# EAGLE design PDV (EAGLE 9.6.0)
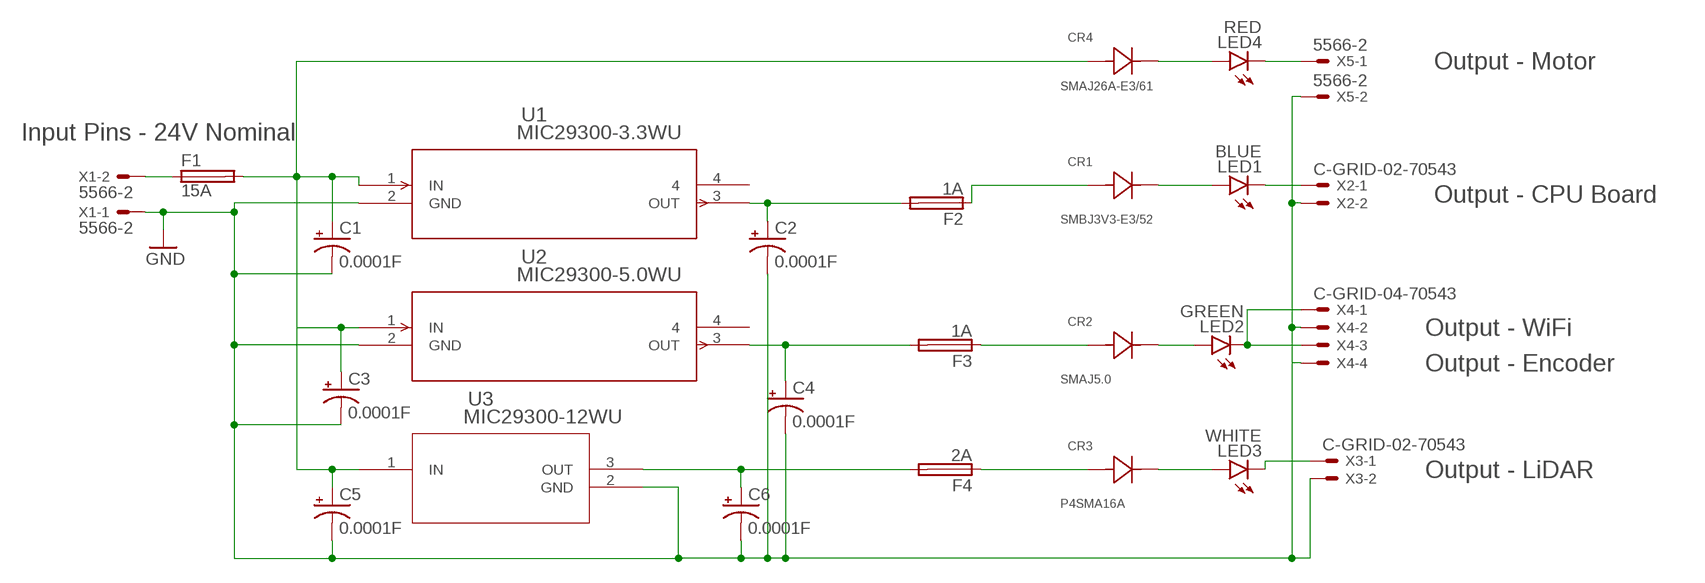
[diagram p0: schematic, sheet 1]

## Parts
C1  0.0001F  CPOL-USE2.5-6  [E2,5-6]
C2  0.0001F  CPOL-USE2.5-6  [E2,5-6]
C3  0.0001F  CPOL-USE2.5-6  [E2,5-6]
C4  0.0001F  CPOL-USE2.5-6  [E2,5-6]
C5  0.0001F  CPOL-USE2.5-6  [E2,5-6]
C6  0.0001F  CPOL-USE2.5-6  [E2,5-6]
CR1  SMBJ3V3-E3/52  [CR_V3-E3/52_VIS]
CR2  SMAJ5.0  [SMASERIES_LTF]
CR3  P4SMA16A  [P4SMASERIES_LTF]
CR4  SMAJ26A-E3/61  [DIODE_DO-214AC]
F1  15A  TE5  [TE5]
F2  1A  TE5  [TE5]
F3  1A  TE5  [TE5]
F4  2A  TE5  [TE5]
LED1  BLUE  LEDSMT1206  [1206]
LED2  GREEN  LEDSMT1206  [1206]
LED3  WHITE  LEDSMT1206  [1206]
LED4  RED  LEDSMT1206  [1206]
U1  MIC29300-3.3WU  [TO-263-3_MCL]
U2  MIC29300-5.0WU  [TO-263-3_MCL]
U3  MIC29300-12WU  [TO220-3LD-PL-1_MCH]
X1  5566-2  [5566-2]
X2  C-GRID-02-70543  [70543-02]
X3  C-GRID-02-70543  [70543-02]
X4  C-GRID-04-70543  [70543-04]
X5  5566-2  [5566-2]

## Nets
GND: C1.- C2.- C3.- C4.- C5.- C6.- U1.2(GND) U2.2(GND) U3.2(GND) X1.1 X2.2 X3.2 X4.2 X4.4 X5.2
N$1: F1.1 X1.2
N$2: C1.+ C3.+ C5.+ CR4.2 F1.2 U1.1(IN) U2.1(IN) U3.1(IN)
N$3: C2.+ F2.2 U1.3(OUT)
N$4: C4.+ F3.2 U2.3(OUT)
N$5: C6.+ F4.2 U3.3(OUT)
N$7: CR1.2 F2.1
N$8: CR2.2 F3.1
N$9: CR3.2 F4.1
N$13: CR4.1 LED4.A
N$14: LED4.C X5.1
N$15: CR1.1 LED1.A
N$16: LED1.C X2.1
N$17: CR2.1 LED2.A
N$18: LED2.C X4.1 X4.3
N$19: CR3.1 LED3.A
N$20: LED3.C X3.1
Unconnected: U1.4 U2.4

## Notes on the sheet
- Output - Motor
- Input Pins - 24V Nominal
- Output - CPU Board
- Output - WiFi
- Output - Encoder
- Output - LiDAR

## Library data of the parts
C1-C6 = rcl:CPOL-US: POLARIZED CAPACITOR, American symbol; SPICEPREFIX: C
CR1 = SMBJ3V3-E3:SMBJ3V3-E3/52; COPYRIGHT: Copyright (C) 2025 Ultra Librarian. All rights reserved.; MANUFACTURER_PART_NUMBER: SMBJ3V3-E3/52; MFR_NAME: Vishay
CR2 = SMAJ5.0:SMAJ5.0; COPYRIGHT: Copyright (C) 2025 Ultra Librarian. All rights reserved.; MANUFACTURER_PART_NUMBER: SMAJ5.0; MFR_NAME: Littelfuse Inc
CR3 = P4SMA16A:P4SMA16A; COPYRIGHT: Copyright (C) 2025 Ultra Librarian. All rights reserved.; MANUFACTURER_PART_NUMBER: P4SMA16A; MFR_NAME: Littelfuse Inc
CR4 = SMAJ26A-E3:SMAJ26A-E3/61; COPYRIGHT: Copyright (C) 2025 Ultra Librarian. All rights reserved.; MANUFACTURER_PART_NUMBER: SMAJ26A-E3/61; MFR_NAME: Vishay
F1-F4 = fuse:TE5: FUSE Wickmann; OC_FARNELL: unknown; OC_NEWARK: unknown
LED1-LED4 = led:LED: LED OSRAM: - CHIPLED LG R971, LG N971, LY N971, LG Q971, LY Q971, LO R971, LY R971 LH N974, LH R974 LS Q976, LO Q976, LY Q976 LO Q996 - Hyper CHIPLED LW Q18S LB Q993, LB Q99A, LB R99A - SideLED LS A670, LO A670, LY A670, LG A670, LP A670 LB A673, LV A673, LT A673, LW A673 LH A674 LY A675 LS A676, LA A676, LO A676, LY A676, LW A676 LS A679, LY A679, LG A679 - Hyper Micro SIDELED® LS Y876, LA Y876, LO Y876, LY Y876 LT Y87S - SmartLED LW L88C, LW L88S LB L89C, LB L89S, LG L890 LS L89K, LO L89K, LY L89K LS L896, LA L896, LO L896, LY L896 - TOPLED LS T670, LO T670, LY T670, LG T670, LP T670 LSG T670, LSP T670, LSY T670, LOP T670, LYG T670 LG T671, LOG T671, LSG T671 LB T673, LV T673, LT T673, LW T673 LH T674 LS T676, LA T676, LO T676, LY T676, LB T676, LH T676, LSB T676, LW T676 LB T67C, LV T67C, LT T67C, LS T67K, LO T67K, LY T67K, LW E67C LS E67B, LA E67B, LO E67B, LY E67B, LB E67C, LV E67C, LT E67C LW T67C LS T679, LY T679, LG T679 LS T770, LO T770, LY T770, LG T770, LP T770 LB T773, LV T773, LT T773, LW T773 LH T774 LS E675, LA E675, LY E675, LS T675 LS T776, LA T776, LO T776, LY T776, LB T776 LHGB T686 LT T68C, LB T68C - Hyper Mini TOPLED® LB M676 - Mini TOPLED Santana® LG M470 LS M47K, LO M47K, LY M47K Source: http://www.osram.convergy.de LUXEON: - LUMILED® LXK2-PW12-R00, LXK2-PW12-S00, LXK2-PW14-U00, LXK2-PW14-V00 LXK2-PM12-R00, LXK2-PM12-S00, LXK2-PM14-U00 LXK2-PE12-Q00, LXK2-PE12-R00, LXK2-PE12-S00, LXK2-PE14-T00, LXK2-PE14-U00 LXK2-PB12-K00, LXK2-PB12-L00, LXK2-PB12-M00, LXK2-PB14-N00, LXK2-PB14-P00, LXK2-PB14-Q00 LXK2-PR12-L00, LXK2-PR12-M00, LXK2-PR14-Q00, LXK2-PR14-R00 LXK2-PD12-Q00, LXK2-PD12-R00, LXK2-PD12-S00 LXK2-PH12-R00, LXK2-PH12-S00 LXK2-PL12-P00, LXK2-PL12-Q00, LXK2-PL12-R00 Source: www.luxeon.com KINGBRIGHT: KA-3528ASYC Source: www.kingbright.com
U1 = MIC29300-3.3:MIC29300-3.3WU; COPYRIGHT: Copyright (C) 2025 Ultra Librarian. All rights reserved.; MANUFACTURER_PART_NUMBER: MIC29300-3.3WU; MFR_NAME: Micrel / Microchip Technology
U2 = MIC29300-5.0lbr:MIC29300-5.0WU; COPYRIGHT: Copyright (C) 2025 Ultra Librarian. All rights reserved.; MANUFACTURER_PART_NUMBER: MIC29300-5.0WU; MFR_NAME: Micrel / Microchip Technology
U3 = MIC29300-12:MIC29300-12WU; COPYRIGHT: Copyright (C) 2025 Ultra Librarian. All rights reserved.; MANUFACTURER_PART_NUMBER: MIC29300-12WU; MFR_NAME: Micrel / Microchip Technology
X1 X5 = con-molex:5566-2: Mini FIT connector 2 pol Source: http://www.molex.com; MF: MOLEX; OC_FARNELL: 1822072; OC_NEWARK: unknown
X2 X3 = con-molex:C-GRID-02: CONNECTOR wire to board 2.54 mm (0.100") pitch header; MF: MOLEX; OC_FARNELL: unknown; OC_NEWARK: unknown
X4 = con-molex:C-GRID-04: CONNECTOR wire to board 2.54 mm (0.100") pitch header; MF: MOLEX; OC_FARNELL: unknown; OC_NEWARK: unknown

## Board
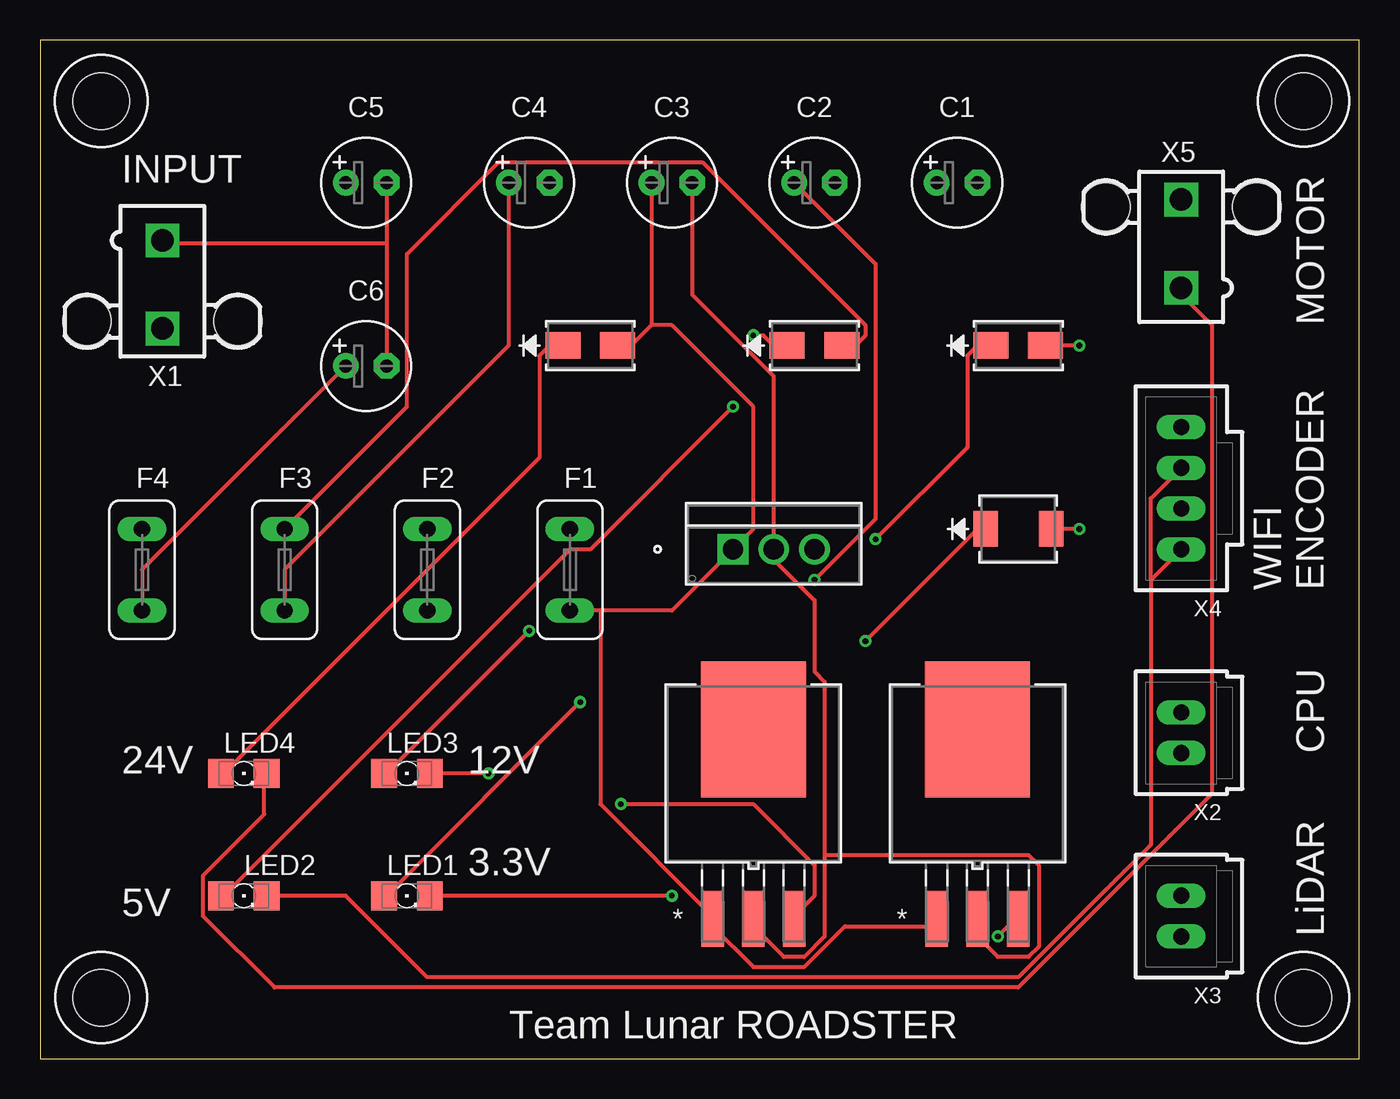
[diagram p1: board, top side]
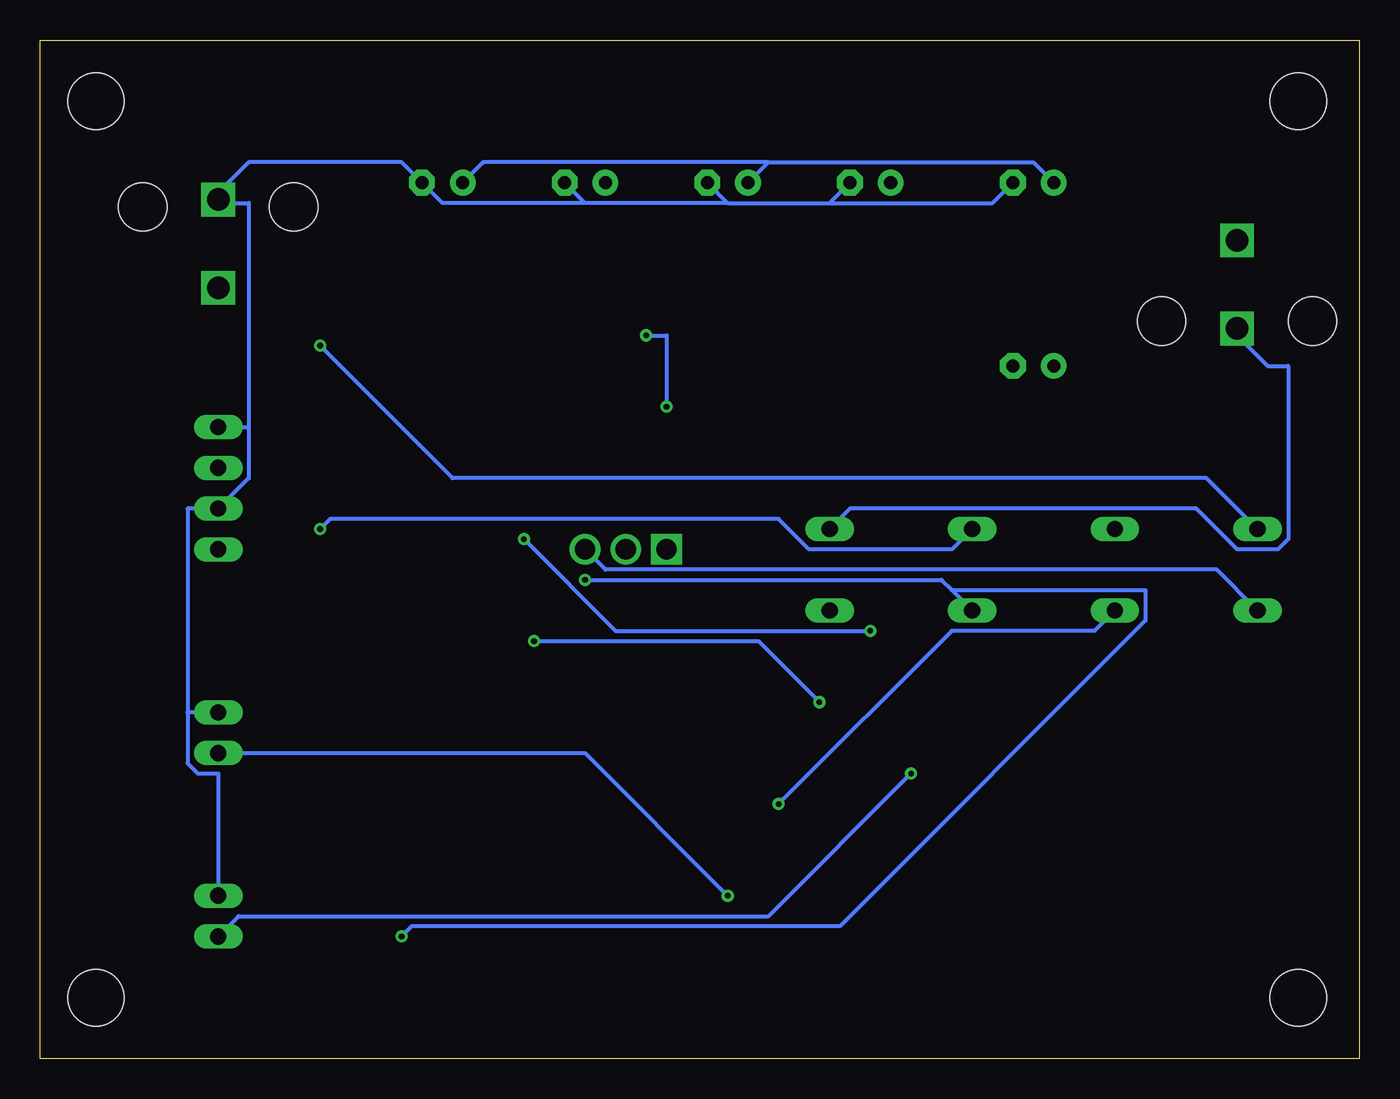
[diagram p2: board, bottom side, seen from below]

Size 82.22 x 63.49 mm. Coordinates in mm from the lower left corner, seen from the top.
Outline: 0,0 82.22,0 82.22,63.49 0,63.49 0,0
Copper layers (1*16): Top 0.035mm / dielectric 1.5mm / Bottom 0.035mm
Design rules "default *": minimum track width 10mil, minimum drill 0.35mm, track to track 6mil, track to pad 6mil, pad to pad 6mil, via to via 6mil, smd to smd 6mil, copper to edge 40mil, drill to drill 6mil, minimum pad ring 10mil, minimum via ring 8mil, stop-mask expansion 4mil, vias tented up to drill 0mil, thermal gap 10mil
Holes 3.51 mm at 3.81,59.69 78.74,59.69 78.74,3.81 3.81,3.81

### Footprints (pad centres in the part's own frame; a part is rotated, then mirrored left to right if it is on the bottom)
E2,5-6 = drill 0.813 pad 1.6: + -1.27,0 | drill 0.813 pad 1.6 octagon: - 1.27,0
CR_V3-E3/52_VIS = smd 1.524 x 2.21: 1 -2.035,0; 2 2.035,0
SMASERIES_LTF = smd 2.184 x 1.651: 1 -1.702,0; 2 1.702,0
P4SMASERIES_LTF = smd 2.184 x 1.651: 1 -1.702,0; 2 1.702,0
DIODE_DO-214AC = smd 2.184 x 1.651: 1 -1.702,0; 2 1.702,0
TE5 = drill 1.016 long: 1 -2.54,0; 2 2.54,0
1206 = smd 1.6 x 1.803: A -1.422,0; C 1.422,0
TO-263-3_MCL = smd 1.397 x 3.505: 1 -2.54,-9.055; 2 0,-9.055; 3 2.54,-9.055 | smd 6.553 x 8.458: 4 0,2.743
TO220-3LD-PL-1_MCH = drill 1.27 pad 1.778 square: 1 0,0 | drill 1.27 pad 1.778: 2 2.54,0; 3 5.08,0
5566-2 = drill 1.4 square: 1 0,-2.75; 2 0,2.75 | hole 3: 4.7,2.29; -4.7,2.29
70543-02 = drill 1.016 long: 1 -1.27,0; 2 1.27,0
70543-04 = drill 1.016 long: 1 -3.81,0; 2 -1.27,0; 3 1.27,0; 4 3.81,0

### Placement (x,y rotation side)
C1  57.15,54.61 0 top
C2  48.26,54.61 0 top
C3  39.37,54.61 0 top
C4  30.48,54.61 0 top
C5  20.32,54.61 0 top
C6  20.32,43.18 0 top
CR1  60.96,33.02 0 top
CR2  48.26,44.45 0 top
CR3  60.96,44.45 0 top
CR4  34.29,44.45 0 top
F1  33.02,30.48 270 top
F2  24.13,30.48 270 top
F3  15.24,30.48 270 top
F4  6.35,30.48 270 top
LED1  22.86,10.16 0 top
LED2  12.7,10.16 0 top
LED3  22.86,17.78 0 top
LED4  12.7,17.78 0 top
U1  58.42,17.78 0 top
U2  44.45,17.78 0 top
U3  43.18,31.75 0 top
X1  7.62,48.26 180 top
X2  71.12,20.32 90 top
X3  71.12,8.89 90 top
X4  71.12,35.56 90 top
X5  71.12,50.8 0 top

### Tracks (layer width: path | path; a pad name or v marks a point on that pad's centre or on a via)
GND
  Top 0.254: 48.89,12.7 48.89,23.5 48.26,24.13 48.26,28.58 45.72,31.12 U3.2 45.72,42.55 40.64,47.62 C3.- | 48.89,12.7 48.89,7.62 47.62,6.35 46.36,6.35 44.45,8.26 U2.2 | U1.2 58.42,7.62 59.69,6.35 61.59,6.35 62.23,6.98 62.23,12.06 61.59,12.7 48.89,12.7 | C5.- 21.59,50.8 | 21.59,50.8 C6.- | 21.59,50.8 7.62,50.8 X1.1
  Bottom 0.254: X3.2 71.12,17.78 72.39,17.78 73.03,18.41 73.03,21.59 | X2.2 73.03,21.59 | 69.22,39.37 69.22,36.2 X4.2 73.03,34.29 73.03,21.59 | X4.4 69.22,39.37 | 33.02,53.34 C4.- | 39.37,53.34 33.02,53.34 | C3.- 39.37,53.34 | 48.26,53.34 C2.- | 39.37,53.34 48.26,53.34 | 48.26,53.34 57.15,53.34 C1.- 59.69,55.88 69.22,55.88 71.12,53.97 X5.2 71.12,53.34 69.22,53.34 69.22,39.37 | C5.- 22.86,53.34 33.02,53.34
N$1
  Bottom 0.254: F1.1 31.75,34.29 10.16,34.29 7.62,31.75 5.08,31.75 4.45,32.38 4.45,43.18 5.71,43.18 7.62,45.09 X1.2
N$2
  Top 0.254: CR4.2 36.83,44.45 38.1,45.72 | C3.+ 38.1,45.72 | 34.92,27.94 39.37,27.94 U3.1 44.45,33.02 44.45,40.64 39.37,45.72 38.1,45.72 | 34.92,27.94 F1.2 | 34.92,27.94 34.92,15.87 41.91,8.89 U2.1 41.91,8.26 44.45,5.71 47.62,5.71 50.16,8.26 55.88,8.26 U1.1
  Bottom 0.254: C5.+ 20.32,55.88 36.83,55.88 | C3.+ 36.83,55.88 | C1.+ 54.61,55.88 36.83,55.88
N$3  (via drill 0.35)
  Top 0.254: v48.26,29.84 52.07,33.66 52.07,49.53 C2.+ | v59.69,7.62 60.33,8.26 60.96,8.26 U1.3
  Bottom 0.254: 25.4,29.21 26.03,29.84 v48.26,29.84 | 25.4,29.21 F2.2 | v59.69,7.62 59.05,8.26 32.38,8.26 13.33,27.3 13.33,29.21 25.4,29.21
N$4  (via drill 0.35)
  Top 0.254: F3.2 15.24,30.48 29.21,44.45 C4.+ | v36.2,15.87 44.45,15.87 48.26,12.06 48.26,10.16 46.99,8.89 U2.3
  Bottom 0.254: v36.2,15.87 25.4,26.67 16.51,26.67 F3.2
N$5
  Top 0.254: F4.2 6.35,30.48 C6.+
  Bottom 0.254: U3.3 46.99,30.48 8.89,30.48 F4.2
N$7  (via drill 0.35)
  Top 0.254: v64.77,33.02 CR1.2
  Bottom 0.254: v64.77,33.02 64.14,33.66 36.2,33.66 34.29,31.75 25.4,31.75 F2.1
N$8
  Top 0.254: CR2.2 50.8,44.45 51.44,45.09 51.44,45.72 41.27,55.88 28.57,55.88 22.86,50.17 22.86,40.64 F3.1
N$9  (via drill 0.35)
  Top 0.254: v64.77,44.45 CR3.2
  Bottom 0.254: v64.77,44.45 56.52,36.2 9.52,36.2 F4.1
N$13
  Top 0.254: CR4.1 31.75,44.45 31.12,43.81 31.12,37.47 11.43,17.78 LED4.A
N$14
  Top 0.254: LED4.C 13.97,17.78 13.97,15.24 10.16,11.43 10.16,8.89 14.6,4.44 60.96,4.44 73.03,16.51 73.03,45.72 71.12,47.62 X5.1
N$15  (via drill 0.35)
  Top 0.254: v33.66,22.23 21.59,10.16 LED1.A | v51.44,26.04 58.42,33.02 CR1.1
  Bottom 0.254: v33.66,22.23 37.46,26.04 v51.44,26.04
N$16  (via drill 0.35)
  Top 0.254: v39.37,10.16 LED1.C
  Bottom 0.254: v39.37,10.16 48.26,19.05 X2.1
N$17  (via drill 0.35)
  Top 0.254: v43.18,40.64 34.29,31.75 33.02,31.75 11.43,10.16 LED2.A | v44.45,45.09 45.09,45.09 45.72,44.45 CR2.1
  Bottom 0.254: v43.18,40.64 43.18,45.09 v44.45,45.09
N$18
  Top 0.254: LED2.C 19.05,10.16 24.13,5.08 60.96,5.08 69.22,13.33 69.22,29.84 | X4.1 69.22,29.84 | X4.3 69.22,34.93 69.22,29.84
N$19  (via drill 0.35)
  Top 0.254: v30.48,26.67 21.59,17.78 LED3.A | v52.07,32.38 57.78,38.1 57.78,43.81 58.42,44.45 CR3.1
  Bottom 0.254: v30.48,26.67 46.36,26.67 v52.07,32.38
N$20  (via drill 0.35)
  Top 0.254: v27.94,17.78 LED3.C
  Bottom 0.254: v27.94,17.78 36.83,8.89 69.85,8.89 X3.1

### Text on the board
tNames: INPUT | MOTOR | WIFI / ENCODER | CPU | 24V | 12V | 3.3V | 5V | LiDAR | Team Lunar ROADSTER